# Altium schematic sheet DB_Power-X03.SchDoc: DB POWER (part 2 of 3)
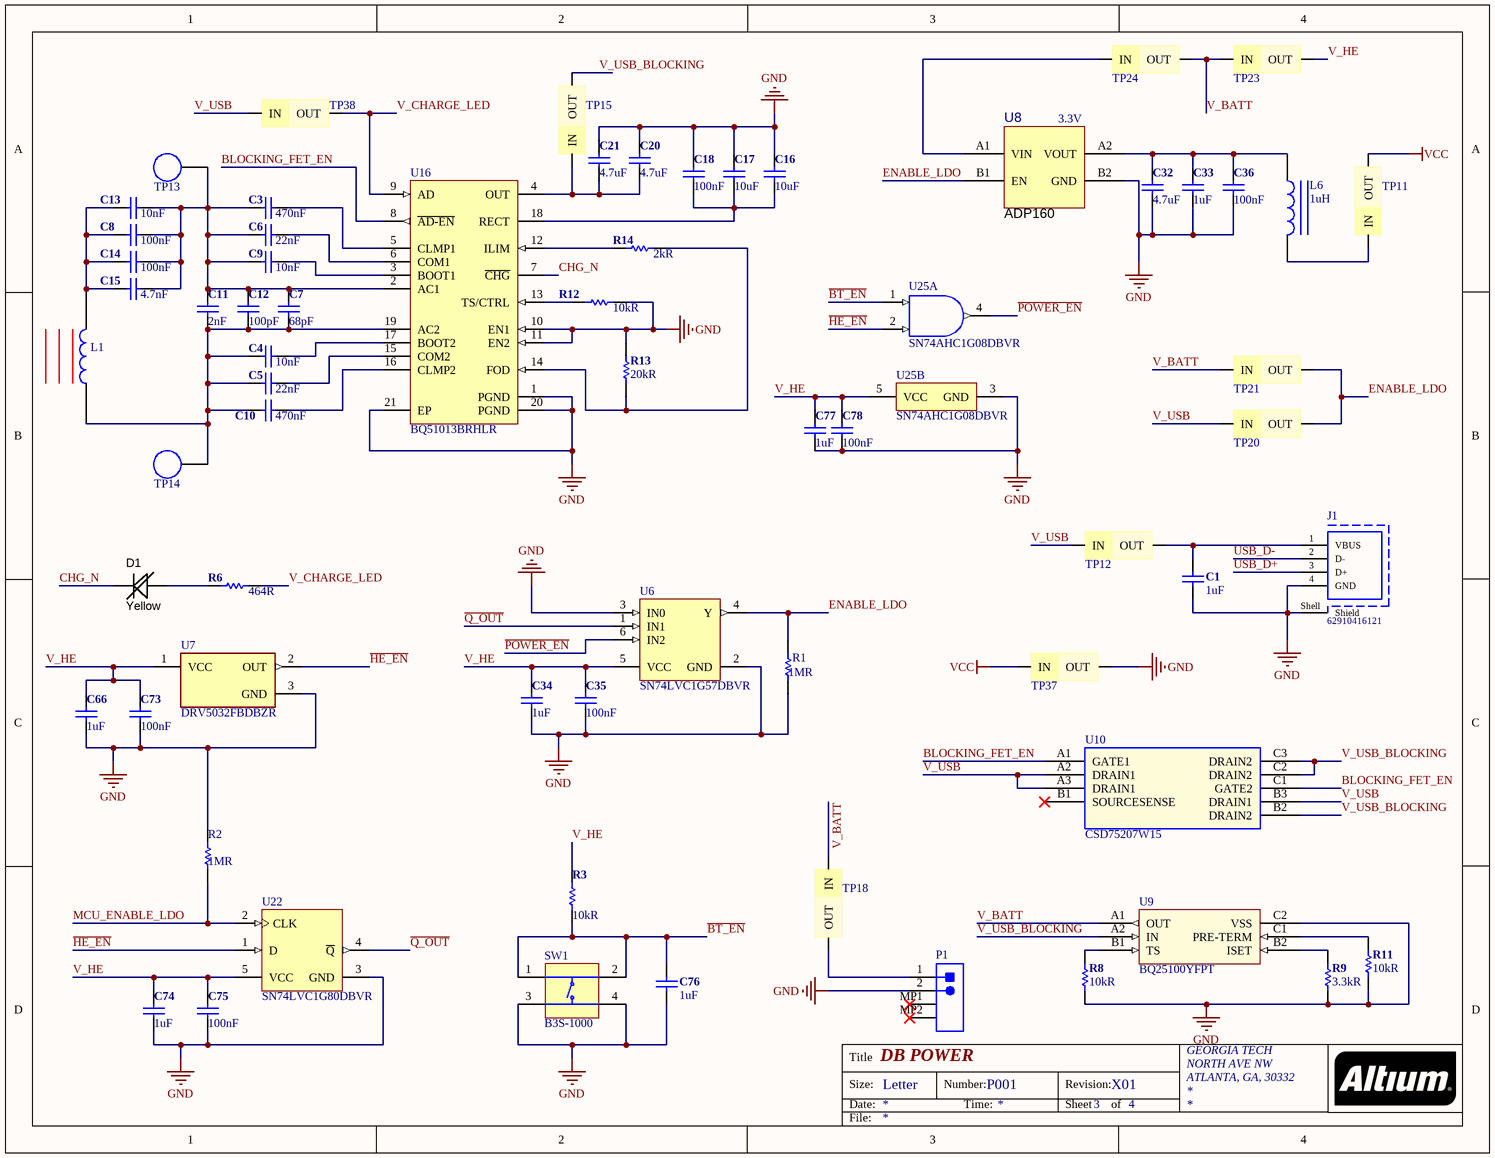
[diagram p1: DB_Power-X03.SchDoc]
## Library data of the parts
C1 C33 C34 C66 C74 C76 C77 = C-0402(1005): Ceramic Capacitor, Multilayer, Ceramic, 6.3V, 20% +Tol, 20% -Tol, X5R, 15% TC, 1uF, Surface Mount, 0402; Manufacturer: Yageo; Manufacturer Part Number: CC0402MRX5R5BB105; Dissipation Factor: 10%; ComponentLink1URL: https://datasheet.ciiva.com/169/product-169683.pdf; ComponentLink1Description: https://datasheet.ciiva.com/169/product-169683.pdf; Supplier 1: Digi-Key; Supplier Part Number 1: 311-1441-1-ND; RoHS: Yes; Category: Ceramic Capacitors; Stock 1: 16697; Pricing 1: 1=0.13000, 10=0.08900, 100=0.04200, 500=0.02946, 1000=0.02439, 2500=0.02270, 5000=0.02076 (USD); Mount: Surface Mount; Case/Package: 0402; Number of Pins: 2; Case Code (Imperial): 0402; Case Code (Metric): 1005; Min Operating Temperature: -55°C; Max Operating Temperature: 85°C; Capacitance: 1uF; Tolerance: 20%; Voltage Rating: 6.3V; Voltage Rating (DC): 6.3V; Packaging: Tape and Reel; Package Quantity: 1; Dielectric: X5R; Termination: SMD/SMT; Composition: Ceramic; Length: 1mm; Height: 0.5mm; Width: 0.5mm; Thickness: 0.022inch; Depth: 0.5mm; Lead Free: Lead Free; Halogen Free: Halogen Free; ComponentLink2URL: https://datasheet.ciiva.com:443/pdfs/VipMasterIC/IC/YAGO/YAGO-S-A0006851646/YAGO-S-A0006851646-1.pdf?src-supplier=IHS+Markit; ComponentLink2Description: https://datasheet.ciiva.com:443/pdfs/VipMasterIC/IC/YAGO/YAGO-S-A0006851646/YAGO-S-A0006851646-1.pdf?src-supplier=IHS+Markit; ComponentLink3URL: https://datasheet.ciiva.com/176/mlccorderingcode-176806.pdf?src-supplier=Digi-Key; ComponentLink3Description: https://datasheet.ciiva.com/176/mlccorderingcode-176806.pdf?src-supplier=Digi-Key; ComponentLink4URL: https://datasheet.ciiva.com/176/mlccorderingcode-176807.pdf?src-supplier=Digi-Key; ComponentLink4Description: https://datasheet.ciiva.com/176/mlccorderingcode-176807.pdf?src-supplier=Digi-Key; ComponentLink5URL: https://datasheet.ciiva.com/176/mlccorderingcode-176808.pdf?src-supplier=Digi-Key; ComponentLink5Description: https://datasheet.ciiva.com/176/mlccorderingcode-176808.pdf?src-supplier=Digi-Key
C3 C10 = C-0402(1005): Ceramic Capacitor, Multilayer, Ceramic, 25V, 20% +Tol, 20% -Tol, X5R, 15% TC, 0.47uF, Surface Mount, 0402; Manufacturer: Murata; Manufacturer Part Number: GRT155R61E474ME01D; ComponentLink1URL: https://datasheet.ciiva.com/169/product-169683.pdf; ComponentLink1Description: https://datasheet.ciiva.com/169/product-169683.pdf; Supplier 1: Digi-Key; Supplier Part Number 1: 490-12270-1-ND; RoHS: Yes; Category: Ceramic Capacitors; Stock 1: 59550; Pricing 1: 1=0.12000, 10=0.08400, 100=0.03930, 500=0.02754, 1000=0.02280, 2500=0.02122, 5000=0.01941 (USD); Mount: Surface Mount; Case/Package: 0402; Case Code (Metric): 1005; Case Code (Imperial): 0402; Min Operating Temperature: -55°C; Max Operating Temperature: 85°C; Packaging: Tape and Reel; Capacitance: 470nF; Voltage Rating: 25V; Tolerance: 20%; Length: 0.039inch; Width: 0.02inch; Thickness: 0.022inch; Ratings: AEC-Q200; ComponentLink2URL: https://datasheet.ciiva.com:443/pdfs/VipMasterIC/IC/MURE/MURE-S-A0004410517/MURE-S-A0004410723-1.pdf?src-supplier=IHS+Markit; ComponentLink2Description: https://datasheet.ciiva.com:443/pdfs/VipMasterIC/IC/MURE/MURE-S-A0004410517/MURE-S-A0004410723-1.pdf?src-supplier=IHS+Markit; ComponentLink3URL: http://search.murata.co.jp/Ceramy/image/img/A01X/G101/ENG/GRT155R61E474ME01-01.pdf?src-supplier=Digi-Key; ComponentLink3Description: http://search.murata.co.jp/Ceramy/image/img/A01X/G101/ENG/GRT155R61E474ME01-01.pdf?src-supplier=Digi-Key
C4 C9 = C-0402(1005): Ceramic Capacitor, Multilayer, Ceramic, 25V, 5% +Tol, 5% -Tol, X7R, 15% TC, 0.01uF, Surface Mount, 0402; Manufacturer: KEMET; Manufacturer Part Number: C0402C103J3RACTU; Dissipation Factor: 3.5%; ComponentLink1URL: https://datasheet.ciiva.com/169/product-169683.pdf; ComponentLink1Description: https://datasheet.ciiva.com/169/product-169683.pdf; Supplier 1: Digi-Key; Supplier Part Number 1: 399-1279-1-ND; RoHS: Yes; Category: Ceramic Capacitors; Stock 1: 2324889; Pricing 1: 1=0.10000, 10=0.05300, 100=0.02360, 500=0.01682, 1000=0.01322, 2500=0.01202, 5000=0.01106 (USD); Mount: Surface Mount,PCB; Case/Package: 0402; Number of Pins: 2; Dielectric Material: Ceramic; Case Code (Metric): 1005; Case Code (Imperial): 0402; Min Operating Temperature: -55°C; Max Operating Temperature: 125°C; Capacitance: 10nF; Packaging: Tape and Reel; Tolerance: 5%; Voltage Rating (DC): 25V; Termination: SMD/SMT; Package Quantity: 1; Voltage Rating: 25V; Dielectric: X7R; Voltage: 25V; Length: 1mm; Height: 0.5mm; Width: 0.02inch; Lead Pitch: 0.3mm; Thickness: 0.022inch; Depth: 0.5mm; Radiation Hardening: No; REACH SVHC: No SVHC; ComponentLink2URL: https://datasheet.ciiva.com:443/pdfs/VipMasterIC/IC/KEME/KEME-S-A0008991654/KEME-S-A0008991654-1.pdf?src-supplier=IHS+Markit; ComponentLink2Description: https://datasheet.ciiva.com:443/pdfs/VipMasterIC/IC/KEME/KEME-S-A0008991654/KEME-S-A0008991654-1.pdf?src-supplier=IHS+Markit; ComponentLink3URL: https://datasheet.ciiva.com/7747/1732724-7747610.pdf?src-supplier=Element14; ComponentLink3Description: https://datasheet.ciiva.com/7747/1732724-7747610.pdf?src-supplier=Element14; ComponentLink4URL: https://datasheet.ciiva.com/14603/70095383-14603973.pdf?src-supplier=Allied+Electronics; ComponentLink4Description: https://datasheet.ciiva.com/14603/70095383-14603973.pdf?src-supplier=Allied+Electronics; ComponentLink5URL: https://datasheet.ciiva.com/14607/70095383-14607438.pdf?src-supplier=Allied+Electronics; ComponentLink5Description: https://datasheet.ciiva.com/14607/70095383-14607438.pdf?src-supplier=Allied+Electronics
C5 C6 = C-0402(1005): Ceramic Capacitor, Multilayer, Ceramic, 25V, 10% +Tol, 10% -Tol, X7R, 15% TC, 0.022uF, Surface Mount, 0402; Manufacturer: Murata; Manufacturer Part Number: GRM155R71E223KA61D; ComponentLink1URL: https://datasheet.ciiva.com/169/product-169683.pdf; ComponentLink1Description: https://datasheet.ciiva.com/169/product-169683.pdf; Supplier 1: Digi-Key; Supplier Part Number 1: 490-3252-1-ND; RoHS: Yes; Category: Ceramic Capacitors; Stock 1: 465669; Pricing 1: 1=0.10000, 10=0.05800, 100=0.02600, 500=0.01860, 1000=0.01461, 2500=0.01328, 5000=0.01222 (USD); Mount: Surface Mount; Case/Package: 0402; Case Code (Metric): 1005; Case Code (Imperial): 0402; Min Operating Temperature: -55°C; Max Operating Temperature: 125°C; Capacitance: 22nF; Tolerance: 10%; Packaging: Tape and Reel; Package Quantity: 1; Voltage Rating: 25V; Dielectric: X7R; Termination: SMD/SMT; Voltage: 25V; Voltage Rating (DC): 25V; Length: 1mm; Height: 0.5mm; Width: 0.02inch; Thickness: 0.022inch; Depth: 0.5mm; Radiation Hardening: No; REACH SVHC: No SVHC; Lead Free: Lead Free; ComponentLink2URL: https://datasheet.ciiva.com:443/pdfs/VipMasterIC/IC/MURE/MURE-S-A0004362469/MURE-S-A0004364485-1.pdf?src-supplier=IHS+Markit; ComponentLink2Description: https://datasheet.ciiva.com:443/pdfs/VipMasterIC/IC/MURE/MURE-S-A0004362469/MURE-S-A0004364485-1.pdf?src-supplier=IHS+Markit; ComponentLink3URL: https://datasheet.ciiva.com/131/product-131108.pdf?src-supplier=Digi-Key; ComponentLink3Description: https://datasheet.ciiva.com/131/product-131108.pdf?src-supplier=Digi-Key; ComponentLink4URL: https://datasheet.ciiva.com/131/grm155r71e223ka61-01-131110.pdf?src-supplier=Digi-Key; ComponentLink4Description: https://datasheet.ciiva.com/131/grm155r71e223ka61-01-131110.pdf?src-supplier=Digi-Key; ComponentLink5URL: https://datasheet.ciiva.com/18184/getdatasheetpartid-178879-18184701.pdf?src-supplier=Verical; ComponentLink5Description: https://datasheet.ciiva.com/18184/getdatasheetpartid-178879-18184701.pdf?src-supplier=Verical; ComponentLink6URL: https://datasheet.ciiva.com/14103/grmseries-highdielectrictype-eng-14103752.pdf?src-supplier=Distrelec; ComponentLink6Description: https://datasheet.ciiva.com/14103/grmseries-highdielectrictype-eng-14103752.pdf?src-supplier=Distrelec; ComponentLink7URL: https://datasheet.ciiva.com/5414/product-5414091.pdf?src-supplier=Mouser; ComponentLink7Description: https://datasheet.ciiva.com/5414/product-5414091.pdf?src-supplier=Mouser; ComponentLink8URL: https://datasheet.ciiva.com/16396/product-16396813.pdf?src-supplier=Future+Electronics; ComponentLink8Description: https://datasheet.ciiva.com/16396/product-16396813.pdf?src-supplier=Future+Electronics; ComponentLink9URL: https://datasheet.ciiva.com/2989/product-2989390.pdf?src-supplier=Avnet; ComponentLink9Description: https://datasheet.ciiva.com/2989/product-2989390.pdf?src-supplier=Avnet
C7 = C-0402(1005): Ceramic Capacitor, Multilayer, Ceramic, 25V, 1% +Tol, 1% -Tol, C0G, 30ppm/Cel TC, 0.000068uF, Surface Mount, 0402; Manufacturer: KEMET; Manufacturer Part Number: CBR04C680F3GAC; ComponentLink1URL: https://datasheet.ciiva.com/169/product-169683.pdf; ComponentLink1Description: https://datasheet.ciiva.com/169/product-169683.pdf; Supplier 1: Digi-Key; Supplier Part Number 1: 399-11255-1-ND; RoHS: Yes; Category: Ceramic Capacitors; Stock 1: 36016; Pricing 1: 1=0.61000, 10=0.43000, 100=0.28320, 500=0.20974, 1000=0.17829, 2500=0.16780, 5000=0.15731 (USD); Mount: Surface Mount; Case/Package: 0402; Weight: 2.3E-05oz; Case Code (Metric): 1005; Case Code (Imperial): 0402; Min Operating Temperature: -55°C; Max Operating Temperature: 125°C; Package Quantity: 10000; Packaging: Tape and Reel; Capacitance: 68pF; Tolerance: 1%; Voltage Rating: 25V; Voltage Rating (DC): 25V; Dielectric: C0G; Termination: SMD/SMT; Length: 0.039inch; Height: 0.5mm; Width: 0.02inch; Thickness: 0.022inch; ComponentLink2URL: https://datasheet.ciiva.com:443/pdfs/VipMasterIC/IC/KEME/KEME-S-A0008534334/KEME-S-A0008534334-1.pdf?src-supplier=IHS+Markit; ComponentLink2Description: https://datasheet.ciiva.com:443/pdfs/VipMasterIC/IC/KEME/KEME-S-A0008534334/KEME-S-A0008534334-1.pdf?src-supplier=IHS+Markit; ComponentLink3URL: https://datasheet.ciiva.com/29542/docfinderpartnumber-cbr04c680f3gac-29542176.pdf?src-supplier=Digi-Key; ComponentLink3Description: https://datasheet.ciiva.com/29542/docfinderpartnumber-cbr04c680f3gac-29542176.pdf?src-supplier=Digi-Key; ComponentLink4URL: https://datasheet.ciiva.com/24220/kem-c1030-cbr-smd-346920-24220761.pdf?src-supplier=Mouser; ComponentLink4Description: https://datasheet.ciiva.com/24220/kem-c1030-cbr-smd-346920-24220761.pdf?src-supplier=Mouser; ComponentLink5URL: https://datasheet.ciiva.com/29542/kem-c1030-cbr-smd-29542174.pdf?src-supplier=Digi-Key; ComponentLink5Description: https://datasheet.ciiva.com/29542/kem-c1030-cbr-smd-29542174.pdf?src-supplier=Digi-Key; ComponentLink6URL: https://datasheet.ciiva.com/29542/kem-c1030-cbr-smd-29542175.pdf?src-supplier=Digi-Key; ComponentLink6Description: https://datasheet.ciiva.com/29542/kem-c1030-cbr-smd-29542175.pdf?src-supplier=Digi-Key
C8 C14 C35 C36 C73 C75 C78 = C-0402(1005): Ceramic Capacitor, Multilayer, Ceramic, 25V, 10% +Tol, 10% -Tol, X5R, 15% TC, 0.1uF, Surface Mount, 0402; Manufacturer: Taiyo Yuden; Manufacturer Part Number: TMK105BJ104KV-F; ComponentLink1URL: https://datasheet.ciiva.com/169/product-169683.pdf; ComponentLink1Description: https://datasheet.ciiva.com/169/product-169683.pdf; Supplier 1: Digi-Key; Supplier Part Number 1: 587-1456-1-ND; RoHS: Yes; Category: Ceramic Capacitors; Stock 1: 27456801; Pricing 1: 1=0.10000, 10=0.04600, 100=0.02050, 500=0.01464, 1000=0.01150, 2500=0.01045, 5000=0.00961 (USD); Mount: Surface Mount; Case/Package: 0402; Number of Pins: 2; Weight: 2.3E-05oz; Case Code (Imperial): 0402; Case Code (Metric): 1005; Min Operating Temperature: -55°C; Max Operating Temperature: 85°C; Capacitance: 100nF; Tolerance: 10%; Packaging: Tape and Reel; Dielectric: X5R; Voltage Rating (DC): 25V; Voltage Rating: 25V; Package Quantity: 1; Termination: SMD/SMT; Composition: Ceramic; Voltage: 25V; Length: 1mm; Height: 0.5mm; Width: 0.5mm; Depth: 0.5mm; Thickness: 0.022inch; REACH SVHC: No SVHC; Lead Free: Lead Free; Halogen Free: Halogen Free; ComponentLink2URL: https://datasheet.ciiva.com:443/pdfs/VipMasterIC/IC/TAIY/TAIY-S-A0009103435/TAIY-S-A0009103038-1.pdf?src-supplier=IHS+Markit; ComponentLink2Description: https://datasheet.ciiva.com:443/pdfs/VipMasterIC/IC/TAIY/TAIY-S-A0009103435/TAIY-S-A0009103038-1.pdf?src-supplier=IHS+Markit; ComponentLink3URL: https://datasheet.ciiva.com/30051/25tmk105bj104kv-f-30051094.pdf?src-supplier=Onlinecomponents.com; ComponentLink3Description: https://datasheet.ciiva.com/30051/25tmk105bj104kv-f-30051094.pdf?src-supplier=Onlinecomponents.com; ComponentLink4URL: https://datasheet.ciiva.com/15922/28tmk105bj104kv-f-15922315.pdf?src-supplier=Onlinecomponents.com; ComponentLink4Description: https://datasheet.ciiva.com/15922/28tmk105bj104kv-f-15922315.pdf?src-supplier=Onlinecomponents.com; ComponentLink5URL: https://datasheet.ciiva.com/131/tmk105bj104kv-f-ss-131420.pdf?src-supplier=Digi-Key; ComponentLink5Description: https://datasheet.ciiva.com/131/tmk105bj104kv-f-ss-131420.pdf?src-supplier=Digi-Key; ComponentLink6URL: https://datasheet.ciiva.com/22768/1693457-22768649.pdf?src-supplier=Farnell; ComponentLink6Description: https://datasheet.ciiva.com/22768/1693457-22768649.pdf?src-supplier=Farnell
C11 = C-0402(1005): Ceramic Capacitor, Multilayer, Ceramic, 25V, 5% +Tol, 5% -Tol, C0G, 30ppm/Cel TC, 0.002uF, Surface Mount, 0402; Manufacturer: KEMET; Manufacturer Part Number: C0402C202J3GACTU; ComponentLink1URL: https://datasheet.ciiva.com/169/product-169683.pdf; ComponentLink1Description: https://datasheet.ciiva.com/169/product-169683.pdf; Supplier 1: Digi-Key; Supplier Part Number 1: 399-9950-1-ND; RoHS: Yes; Category: Ceramic Capacitors; Stock 1: 112214; Pricing 1: 1=0.54000, 10=0.37900, 100=0.24970, 500=0.18496, 1000=0.15721, 2500=0.14796, 5000=0.13872 (USD); Mount: Surface Mount; Case/Package: 0402; Number of Pins: 2; Case Code (Metric): 1005; Case Code (Imperial): 0402; Dielectric Material: Ceramic; Min Operating Temperature: -55°C; Max Operating Temperature: 125°C; Capacitance: 2nF; Tolerance: 5%; Voltage Rating: 25V; Packaging: Cut Tape; Dielectric: C0G; Voltage Rating (DC): 25V; Package Quantity: 1; Length: 0.039inch; Lead Pitch: 0.3mm; Width: 0.02inch; Thickness: 0.022inch; Depth: 0.5mm; REACH SVHC: No SVHC; Lead Free: Lead Free; ComponentLink2URL: https://datasheet.ciiva.com:443/pdfs/VipMasterIC/IC/KEME/KEME-S-A0007617622/KEME-S-A0007609746-1.pdf?src-supplier=IHS+Markit; ComponentLink2Description: https://datasheet.ciiva.com:443/pdfs/VipMasterIC/IC/KEME/KEME-S-A0007617622/KEME-S-A0007609746-1.pdf?src-supplier=IHS+Markit; ComponentLink3URL: https://datasheet.ciiva.com/7747/1691965-7747484.pdf?src-supplier=Element14; ComponentLink3Description: https://datasheet.ciiva.com/7747/1691965-7747484.pdf?src-supplier=Element14; ComponentLink4URL: https://datasheet.ciiva.com/22693/1691965-22693900.pdf?src-supplier=Element14; ComponentLink4Description: https://datasheet.ciiva.com/22693/1691965-22693900.pdf?src-supplier=Element14
C12 = C-0402(1005): Ceramic Capacitor, Multilayer, Ceramic, 25V, 1% +Tol, 1% -Tol, C0G, -/+30ppm/Cel TC, 0.0001uF, 0402; Manufacturer: KEMET; Manufacturer Part Number: CBR04C101F3GAC; ComponentLink1URL: https://datasheet.ciiva.com/169/product-169683.pdf; ComponentLink1Description: https://datasheet.ciiva.com/169/product-169683.pdf; Supplier 1: Digi-Key; Supplier Part Number 1: 399-11246-1-ND; RoHS: Yes; Category: Ceramic Capacitors; Stock 1: 35333; Pricing 1: 1=0.57000, 10=0.40300, 100=0.26540, 500=0.19660, 1000=0.16710, 2500=0.15727, 5000=0.14744 (USD); Mount: Surface Mount; Case/Package: 0402; Weight: 2.3E-05oz; Case Code (Imperial): 0402; Case Code (Metric): 1005; Contact Plating: Tin,Matte; Min Operating Temperature: -55°C; Max Operating Temperature: 125°C; Capacitance: 100pF; Voltage Rating (DC): 25V; Tolerance: 1%; Packaging: Tape and Reel; Package Quantity: 10000; Voltage Rating: 25V; Dielectric: C0G; Termination: SMD/SMT; Length: 1mm; Height: 0.5mm; Width: 0.5mm; Thickness: 0.022inch; Lead Free: Lead Free; ComponentLink2URL: https://datasheet.ciiva.com:443/pdfs/VipMasterIC/IC/KEME/KEME-S-A0008534334/KEME-S-A0008534334-1.pdf?src-supplier=IHS+Markit; ComponentLink2Description: https://datasheet.ciiva.com:443/pdfs/VipMasterIC/IC/KEME/KEME-S-A0008534334/KEME-S-A0008534334-1.pdf?src-supplier=IHS+Markit; ComponentLink3URL: https://datasheet.ciiva.com/29541/docfinderpartnumber-cbr04c101f3gac-29541052.pdf?src-supplier=Digi-Key; ComponentLink3Description: https://datasheet.ciiva.com/29541/docfinderpartnumber-cbr04c101f3gac-29541052.pdf?src-supplier=Digi-Key; ComponentLink4URL: https://datasheet.ciiva.com/29541/kem-c1030-cbr-smd-29541054.pdf?src-supplier=Digi-Key; ComponentLink4Description: https://datasheet.ciiva.com/29541/kem-c1030-cbr-smd-29541054.pdf?src-supplier=Digi-Key; ComponentLink5URL: https://datasheet.ciiva.com/29541/kem-c1030-cbr-smd-29541053.pdf?src-supplier=Digi-Key; ComponentLink5Description: https://datasheet.ciiva.com/29541/kem-c1030-cbr-smd-29541053.pdf?src-supplier=Digi-Key
C13 = C-0402(1005): Ceramic Capacitor, Multilayer, Ceramic, 25V, 5% +Tol, 5% -Tol, X7R, 15% TC, 0.01uF, Surface Mount, 0402; Manufacturer: Yageo; Manufacturer Part Number: CC0402JRX7R8BB103; ComponentLink1URL: https://datasheet.ciiva.com/169/product-169683.pdf; ComponentLink1Description: https://datasheet.ciiva.com/169/product-169683.pdf; Supplier 1: Digi-Key; Supplier Part Number 1: 311-1677-1-ND; RoHS: Yes; Category: Ceramic Capacitors; Stock 1: 22771; Pricing 1: 1=0.10000, 10=0.04200, 100=0.01890, 500=0.01348, 1000=0.01059, 2500=0.00962, 5000=0.00886 (USD); Mount: Surface Mount; Case/Package: 0402; Weight: 2.3E-05oz; Case Code (Imperial): 0402; Case Code (Metric): 1005; Min Operating Temperature: -55°C; Max Operating Temperature: 125°C; Capacitance: 10nF; Tolerance: 5%; Dielectric: X7R; Packaging: Tape and Reel; Voltage Rating: 25V; Voltage Rating (DC): 25V; Termination: SMD/SMT; Composition: Ceramic; Length: 1mm; Height: 0.5mm; Width: 0.02inch; Thickness: 0.022inch; Depth: 0.5mm; Radiation Hardening: No; Lead Free: Lead Free; Halogen Free: Halogen Free; ComponentLink2URL: https://datasheet.ciiva.com:443/pdfs/VipMasterIC/IC/YAGO/YAGO-S-A0003557223/YAGO-S-A0003557223-1.pdf?src-supplier=IHS+Markit; ComponentLink2Description: https://datasheet.ciiva.com:443/pdfs/VipMasterIC/IC/YAGO/YAGO-S-A0003557223/YAGO-S-A0003557223-1.pdf?src-supplier=IHS+Markit; ComponentLink3URL: https://datasheet.ciiva.com/13208/upy-gphc-x7r-6-3v-to-50v-8-12304-13208812.pdf?src-supplier=Mouser; ComponentLink3Description: https://datasheet.ciiva.com/13208/upy-gphc-x7r-6-3v-to-50v-8-12304-13208812.pdf?src-supplier=Mouser; ComponentLink4URL: https://datasheet.ciiva.com/17434/upy-gphc-x7r-6-3v-to-50v-8-17434365.pdf?src-supplier=Avnet+Europe; ComponentLink4Description: https://datasheet.ciiva.com/17434/upy-gphc-x7r-6-3v-to-50v-8-17434365.pdf?src-supplier=Avnet+Europe
C15 = C-0402(1005): Ceramic Capacitor, Multilayer, Ceramic, 25V, 5% +Tol, 5% -Tol, X7R, 15% TC, 0.0047uF, Surface Mount, 0402; Manufacturer: Yageo; Manufacturer Part Number: CC0402JRX7R8BB472; ComponentLink1URL: https://datasheet.ciiva.com/169/product-169683.pdf; ComponentLink1Description: https://datasheet.ciiva.com/169/product-169683.pdf; Supplier 1: Digi-Key; Supplier Part Number 1: 311-3761-1-ND; RoHS: Yes; Category: Ceramic Capacitors; Stock 1: 13197; Pricing 1: 1=0.10000, 10=0.03800, 100=0.01710, 500=0.01224, 1000=0.00962, 2500=0.00874, 5000=0.00805 (USD); Mount: Surface Mount; Case/Package: 0402; Case Code (Imperial): 0402; Case Code (Metric): 1005; Min Operating Temperature: -55°C; Max Operating Temperature: 125°C; Voltage Rating (DC): 25V; Tolerance: 5%; Packaging: Tape and Reel; Capacitance: 4.7nF; Package Quantity: 10000; Voltage Rating: 25V; Termination: SMD/SMT; Dielectric: X7R; Length: 0.039inch; Width: 0.02inch; Thickness: 0.022inch; Depth: 0.5mm; Lead Free: Lead Free; Halogen Free: Halogen Free; ComponentLink2URL: https://datasheet.ciiva.com:443/pdfs/VipMasterIC/IC/YAGO/YAGO-S-A0003557223/YAGO-S-A0003557223-1.pdf?src-supplier=IHS+Markit; ComponentLink2Description: https://datasheet.ciiva.com:443/pdfs/VipMasterIC/IC/YAGO/YAGO-S-A0003557223/YAGO-S-A0003557223-1.pdf?src-supplier=IHS+Markit; ComponentLink3URL: https://datasheet.ciiva.com/5427/upy-gphc-x7r-6-3v-to-50v-8-12304-5427753.pdf?src-supplier=Mouser; ComponentLink3Description: https://datasheet.ciiva.com/5427/upy-gphc-x7r-6-3v-to-50v-8-12304-5427753.pdf?src-supplier=Mouser
C16 C17 = C-0603(1608): Ceramic Capacitor, Multilayer, Ceramic, 25V, 20% +Tol, 20% -Tol, X5R, 15% TC, 10uF, Surface Mount, 0603; Manufacturer: Murata; Manufacturer Part Number: GRM188R61E106MA73J; ComponentLink1URL: https://datasheet.ciiva.com/169/product-169683.pdf; ComponentLink1Description: https://datasheet.ciiva.com/169/product-169683.pdf; Supplier 1: Digi-Key; Supplier Part Number 1: 490-12737-1-ND; RoHS: Yes; Category: Ceramic Capacitors; Stock 1: 57394; Pricing 1: 1=0.46000, 10=0.32200, 100=0.19320, 500=0.14488, 1000=0.12235, 2500=0.11591, 5000=0.10947 (USD); Mount: Surface Mount; Case/Package: 0603; Weight: 0.000222oz; Case Code (Imperial): 0603; Case Code (Metric): 1608; Min Operating Temperature: -55°C; Max Operating Temperature: 85°C; Tolerance: 20%; Packaging: Tape and Reel; Capacitance: 10uF; Voltage Rating: 25V; Dielectric: X5R; Termination: SMD/SMT; Composition: Ceramic; Voltage Rating (DC): 25V; Package Quantity: 10000; Length: 0.063inch; Height: 0.8mm; Width: 0.031inch; Thickness: 0.039inch; ComponentLink2URL: https://datasheet.ciiva.com:443/pdfs/VipMasterIC/IC/MURE/MURE-S-A0004349797/MURE-S-A0004352800-1.pdf?src-supplier=IHS+Markit; ComponentLink2Description: https://datasheet.ciiva.com:443/pdfs/VipMasterIC/IC/MURE/MURE-S-A0004349797/MURE-S-A0004352800-1.pdf?src-supplier=IHS+Markit; ComponentLink3URL: http://www.mouser.com/ds/2/281/GRM188R61E106MA73-01-1064626.pdf?src-supplier=Mouser; ComponentLink3Description: http://www.mouser.com/ds/2/281/GRM188R61E106MA73-01-1064626.pdf?src-supplier=Mouser; ComponentLink4URL: https://search.murata.co.jp/Ceramy/image/img/A01X/G101/ENG/GRM188R61E106MA73-01.pdf?src-supplier=Digi-Key; ComponentLink4Description: https://search.murata.co.jp/Ceramy/image/img/A01X/G101/ENG/GRM188R61E106MA73-01.pdf?src-supplier=Digi-Key
C18 = C-0603(1608): Ceramic Capacitor, Multilayer, Ceramic, 25V, 80% +Tol, 20% -Tol, Y5V, -82/+22% TC, 0.1uF, Surface Mount, 0402; Manufacturer: Yageo; Manufacturer Part Number: CC0402ZRY5V8BB104; Dissipation Factor: 12.5%; Insulation Resistance: 10GR; ComponentLink1URL: https://datasheet.ciiva.com/169/product-169683.pdf; ComponentLink1Description: https://datasheet.ciiva.com/169/product-169683.pdf; Supplier 1: Digi-Key; Supplier Part Number 1: 311-1375-1-ND; RoHS: Yes; Category: Ceramic Capacitors; Stock 1: 3200380; Pricing 1: 1=0.10000, 10=0.03200, 100=0.01440, 500=0.01028, 1000=0.00808, 2500=0.00734, 5000=0.00676 (USD); Mount: Surface Mount; Case/Package: 0402; Number of Pins: 2; Weight: 2.3E-05oz; Case Code (Metric): 1005; Case Code (Imperial): 0402; Min Operating Temperature: -30°C; Max Operating Temperature: 85°C; Packaging: Tape and Reel; Capacitance: 100nF; Tolerance: 80%; Voltage Rating: 25V; Voltage Rating (DC): 25V; Package Quantity: 1; Dielectric: Y5V; Termination: SMD/SMT; Composition: Ceramic; Length: 1mm; Height: 0.5mm; Width: 0.02inch; Thickness: 0.022inch; Depth: 0.5mm; Radiation Hardening: No; REACH SVHC: Unknown; Lead Free: Lead Free; Halogen Free: Halogen Free; ComponentLink2URL: https://datasheet.ciiva.com:443/pdfs/VipMasterIC/IC/YAGO/YAGO-S-A0004841839/YAGO-S-A0004841839-1.pdf?src-supplier=IHS+Markit; ComponentLink2Description: https://datasheet.ciiva.com:443/pdfs/VipMasterIC/IC/YAGO/YAGO-S-A0004841839/YAGO-S-A0004841839-1.pdf?src-supplier=IHS+Markit; ComponentLink3URL: https://datasheet.ciiva.com/144/mlccorderingcode-144022.pdf?src-supplier=Digi-Key; ComponentLink3Description: https://datasheet.ciiva.com/144/mlccorderingcode-144022.pdf?src-supplier=Digi-Key; ComponentLink4URL: https://datasheet.ciiva.com/144/mlccorderingcode-144023.pdf?src-supplier=Digi-Key; ComponentLink4Description: https://datasheet.ciiva.com/144/mlccorderingcode-144023.pdf?src-supplier=Digi-Key; ComponentLink5URL: https://datasheet.ciiva.com/144/mlccorderingcode-144024.pdf?src-supplier=Digi-Key; ComponentLink5Description: https://datasheet.ciiva.com/144/mlccorderingcode-144024.pdf?src-supplier=Digi-Key; ComponentLink6URL: https://datasheet.ciiva.com/7978/1132289-7978124.pdf?src-supplier=Element14; ComponentLink6Description: https://datasheet.ciiva.com/7978/1132289-7978124.pdf?src-supplier=Element14; ComponentLink7URL: https://datasheet.ciiva.com/11586/upy-gphc-y5v-6-3v-to-50v-5-11586526.pdf?src-supplier=Avnet; ComponentLink7Description: https://datasheet.ciiva.com/11586/upy-gphc-y5v-6-3v-to-50v-5-11586526.pdf?src-supplier=Avnet; ComponentLink8URL: https://datasheet.ciiva.com/17437/upy-gphc-y5v-6-3v-to-50v-5-17437230.pdf?src-supplier=Avnet+Europe; ComponentLink8Description: https://datasheet.ciiva.com/17437/upy-gphc-y5v-6-3v-to-50v-5-17437230.pdf?src-supplier=Avnet+Europe
C20 C21 C32 = C-0402(1005): 0402 10 V 4.7 uF ±20% Tolerance X5R Multilayer Ceramic Chip Capacitor; Manufacturer: Murata; Manufacturer Part Number: GRM155R61A475MEAAD; Voltage Rating: 10V; ComponentLink1URL: https://datasheet.ciiva.com/169/product-169683.pdf; ComponentLink1Description: https://datasheet.ciiva.com/169/product-169683.pdf; Supplier 1: Digi-Key; Supplier Part Number 1: 490-14306-1-ND; Category: Ceramic Capacitors; Stock 1: 420733; Pricing 1: 1=0.25000, 10=0.16900, 100=0.08560, 500=0.05854, 1000=0.05179, 2500=0.04954, 5000=0.04503 (USD); Mount: Surface Mount; Case/Package: 0402; Case Code (Imperial): 0402; Case Code (Metric): 1005; Min Operating Temperature: -55°C; Max Operating Temperature: 85°C; Packaging: Tape and Reel; Capacitance: 4.7uF; Tolerance: 20%; ComponentLink2URL: https://psearch.en.murata.com:443/capacitor/product/GRM155R61A475MEAA%23.pdf?src-supplier=IHS+Markit; ComponentLink2Description: https://psearch.en.murata.com:443/capacitor/product/GRM155R61A475MEAA%23.pdf?src-supplier=IHS+Markit; ComponentLink3URL: http://www.farnell.com/datasheets/2189109.pdf?src-supplier=Farnell; ComponentLink3Description: http://www.farnell.com/datasheets/2189109.pdf?src-supplier=Farnell; ComponentLink4URL: https://search.murata.co.jp/Ceramy/image/img/A01X/G101/ENG/GRM155R61A475MEAA-01.pdf?src-supplier=Digi-Key; ComponentLink4Description: https://search.murata.co.jp/Ceramy/image/img/A01X/G101/ENG/GRM155R61A475MEAA-01.pdf?src-supplier=Digi-Key; ComponentLink5URL: http://www.farnell.com/datasheets/2189109.pdf?src-supplier=Element14; ComponentLink5Description: http://www.farnell.com/datasheets/2189109.pdf?src-supplier=Element14; ComponentLink6URL: http://www.farnell.com/datasheets/2189109.pdf?src-supplier=Newark; ComponentLink6Description: http://www.farnell.com/datasheets/2189109.pdf?src-supplier=Newark; ComponentLink7URL: http://datasheet.octopart.com/GRM155R61A475MEAAD-Murata-datasheet-138740730.pdf?src-supplier=Ciiva+Crawler; ComponentLink7Description: http://datasheet.octopart.com/GRM155R61A475MEAAD-Murata-datasheet-138740730.pdf?src-supplier=Ciiva+Crawler; ComponentLink8URL: http://datasheet.octopart.com/GRM155R61A475MEAAD-Murata-datasheet-140690084.pdf?src-supplier=Ciiva+Crawler; ComponentLink8Description: http://datasheet.octopart.com/GRM155R61A475MEAAD-Murata-datasheet-140690084.pdf?src-supplier=Ciiva+Crawler; ComponentLink9URL: http://datasheet.octopart.com/GRM155R61A475MEAAD-Murata-datasheet-68589269.pdf?src-supplier=Newark; ComponentLink9Description: http://datasheet.octopart.com/GRM155R61A475MEAAD-Murata-datasheet-68589269.pdf?src-supplier=Newark; ComponentLink10URL: http://datasheet.octopart.com/GRM155R61A475MEAAD-Murata-datasheet-8819587.pdf; ComponentLink10Description: http://datasheet.octopart.com/GRM155R61A475MEAAD-Murata-datasheet-8819587.pdf; ComponentLink11URL: http://datasheet.octopart.com/GRM155R61A475MEAAD-Murata-datasheet-10025737.pdf; ComponentLink11Description: http://datasheet.octopart.com/GRM155R61A475MEAAD-Murata-datasheet-10025737.pdf; ComponentLink12URL: http://datasheet.octopart.com/GRM155R61A475MEAAD-Murata-datasheet-11978611.pdf; ComponentLink12Description: http://datasheet.octopart.com/GRM155R61A475MEAAD-Murata-datasheet-11978611.pdf; ComponentLink13URL: http://datasheet.octopart.com/GRM155R61A475MEAAD-Murata-datasheet-12510076.pdf; ComponentLink13Description: http://datasheet.octopart.com/GRM155R61A475MEAAD-Murata-datasheet-12510076.pdf; ComponentLink14URL: http://datasheet.octopart.com/GRM155R61A475MEAAD-Murata-datasheet-12515295.pdf; ComponentLink14Description: http://datasheet.octopart.com/GRM155R61A475MEAAD-Murata-datasheet-12515295.pdf
D1 = LED_0402(1005): Single Color LED, Super Bright Yellow, Water Clear, 0.8mm; Manufacturer: Kingbright; Manufacturer Part Number: APHHS1005SYCK; Test Current: 20mA; Forward Voltage: 2V; Luminous Intensity: 150mcd; Viewing Angle: 120°; Number of LEDs: 1; Dominant Wavelength: 590nm; Lens Style: Clear,Flat; Supplier 1: Digi-Key; Supplier Part Number 1: 754-1105-1-ND; RoHS: Yes; Category: LEDs; Stock 1: 1790; Pricing 1: 1=0.44000, 10=0.31200, 100=0.18200, 500=0.12480, 1000=0.10400 (USD); Mount: Surface Mount; Case/Package: 0402; Number of Pins: 2; Color: Yellow; Case Code (Imperial): 0402; Case Code (Metric): 1005; Lens Color: Clear; Min Operating Temperature: -40°C; Max Operating Temperature: 85°C; Illumination Color: Yellow; Forward Current: 20mA; Packaging: Tape and Reel; Package Quantity: 2000; Length: 1mm; Height: 0.6mm; Width: 0.5mm; Lead Free: Lead Free; ComponentLink1URL: https://datasheet.ciiva.com:443/pdfs/VipMasterIC/IC/KBEC/KBEC-S-A0008947180/KBEC-S-A0008958019-1.pdf?src-supplier=IHS+Markit; ComponentLink1Description: https://datasheet.ciiva.com:443/pdfs/VipMasterIC/IC/KBEC/KBEC-S-A0008947180/KBEC-S-A0008958019-1.pdf?src-supplier=IHS+Markit; ComponentLink2URL: https://datasheet.ciiva.com/4688/aphhs1005syck-76875-4688936.pdf?src-supplier=Mouser; ComponentLink2Description: https://datasheet.ciiva.com/4688/aphhs1005syck-76875-4688936.pdf?src-supplier=Mouser; ComponentLink3URL: https://datasheet.ciiva.com/2114/aphhs1005syck-2114041.pdf?src-supplier=Digi-Key; ComponentLink3Description: https://datasheet.ciiva.com/2114/aphhs1005syck-2114041.pdf?src-supplier=Digi-Key; ComponentLink4URL: https://datasheet.ciiva.com/14603/70062834-14603866.pdf?src-supplier=Allied+Electronics; ComponentLink4Description: https://datasheet.ciiva.com/14603/70062834-14603866.pdf?src-supplier=Allied+Electronics; ComponentLink5URL: https://datasheet.ciiva.com/2114/aphhs1005syck-2114043.pdf?src-supplier=Digi-Key; ComponentLink5Description: https://datasheet.ciiva.com/2114/aphhs1005syck-2114043.pdf?src-supplier=Digi-Key; ComponentLink6URL: https://datasheet.ciiva.com/16412/aphhs1005syck-16412188.pdf?src-supplier=Future+Electronics; ComponentLink6Description: https://datasheet.ciiva.com/16412/aphhs1005syck-16412188.pdf?src-supplier=Future+Electronics
J1 = CMP-1502-03244-1: USB 2.0 Type B Receptacle WR-COM, Horizontal, SMT, with Pads and Pegs; Manufacturer: Wurth Electronics; Number of Contacts: 4; USB Standard: USB 2.0; Number of Ports: 1; Current Rating: 1.5A; Mating Cycles: 1500; Shielding: Shielded; Supplier 1: Digi-Key; Supplier Part Number 1: 732-3152-1-ND; Manufacturer Part Number: 62910416121; RoHS: Yes; Category: Connectors; Stock 1: 80; Pricing 1: 1=3.83000, 10=3.76300, 50=3.49400, 100=3.22600 (USD); Mount: Surface Mount; Contact Plating: Gold; Contact Material: Copper Alloy; Insulation Color: Black; Min Operating Temperature: -40°C; Max Operating Temperature: 105°C; Package Quantity: 150; Packaging: Tape and Reel; Gender: Receptacle; Connector Type: USB; Termination: Solder; Orientation: Right Angle; Features: Shielded; Length: 16mm; REACH SVHC: Unknown; Lead Free: Lead Free; Flammability Rating: UL94 V-0; ComponentLink1URL: https://datasheet.ciiva.com:443/pdfs/VipMasterIC/IC/MIDC/MIDC-S-A0004022663/MIDC-S-A0003061583-1.pdf?src-supplier=IHS+Markit; ComponentLink1Description: https://datasheet.ciiva.com:443/pdfs/VipMasterIC/IC/MIDC/MIDC-S-A0004022663/MIDC-S-A0003061583-1.pdf?src-supplier=IHS+Markit; ComponentLink2URL: https://datasheet.ciiva.com/851/62910416121-851244.pdf?src-supplier=Digi-Key; ComponentLink2Description: https://datasheet.ciiva.com/851/62910416121-851244.pdf?src-supplier=Digi-Key; ComponentLink3URL: https://datasheet.ciiva.com/851/62910416121-851245.pdf?src-supplier=Digi-Key; ComponentLink3Description: https://datasheet.ciiva.com/851/62910416121-851245.pdf?src-supplier=Digi-Key; ComponentLink4URL: https://datasheet.ciiva.com/851/62910416121-851246.pdf?src-supplier=Digi-Key; ComponentLink4Description: https://datasheet.ciiva.com/851/62910416121-851246.pdf?src-supplier=Digi-Key
L1 = WIRELESS_CHARGING_COIL: General Purpose Inductor, 11.8uH, 10%, 1 Element; Manufacturer: Wurth Electronics; Current Rating: 700mA; Saturation Current: 1.5A; DC Resistance (DCR): 750mR; Self Resonant Frequency: 22MHz; Supplier 1: Digi-Key; Supplier Part Number 1: 732-9675-ND; Manufacturer Part Number: 760308101219; RoHS: Yes; Stock 1: 168; Pricing 1: 1=7.43000, 10=7.04000, 32=6.49000, 64=5.94000, 128=5.17000 (USD); Min Operating Temperature: -20°C; Max Operating Temperature: 105°C; Logic Function: Receiver; Inductance: 11.8uH; Tolerance: 10%; Inductance Tolerance: 10%; Height: 0.02inch; REACH SVHC: Unknown; ComponentLink1URL: https://datasheet.ciiva.com:443/pdfs/VipMasterIC/IC/MIDC/MIDC-S-A0003386501/MIDC-S-A0003386501-1.pdf?src-supplier=IHS+Markit; ComponentLink1Description: https://datasheet.ciiva.com:443/pdfs/VipMasterIC/IC/MIDC/MIDC-S-A0003386501/MIDC-S-A0003386501-1.pdf?src-supplier=IHS+Markit; ComponentLink2URL: http://www.farnell.com/datasheets/2039993.pdf?src-supplier=Farnell; ComponentLink2Description: http://www.farnell.com/datasheets/2039993.pdf?src-supplier=Farnell; ComponentLink3URL: http://www.farnell.com/datasheets/2039993.pdf?src-supplier=Element14; ComponentLink3Description: http://www.farnell.com/datasheets/2039993.pdf?src-supplier=Element14
L6 = Inductor Iron: General Purpose Inductor, 1uH, 20%, 1 Element, Ferrite-Core, SMD, 0402; Manufacturer: TDK; Manufacturer Part Number: MLZ1005M1R0WT000; Current Rating: 450mA; Saturation Current: 100mA; Shielding: Shielded; DC Resistance (DCR): 455mR; Self Resonant Frequency: 170MHz; Test Frequency: 2MHz; Supplier 1: Digi-Key; Supplier Part Number 1: 445-6379-1-ND; RoHS: Yes; Category: Fixed Inductors; Pricing 1: 1=0.29000, 10=0.25800, 100=0.17710, 500=0.15134, 1000=0.11592, 2500=0.10948 (USD); Mount: Surface Mount; Case/Package: 0402; Core Material: Ferrite; Case Code (Imperial): 0402; Case Code (Metric): 1005; Min Operating Temperature: -55°C; Max Operating Temperature: 125°C; Package Quantity: 10000; Packaging: Tape and Reel; Tolerance: 20%; Inductance: 1uH; Length: 0.039inch; Width: 0.02inch; Height - Seated (Max): 0.022inch; ComponentLink1URL: https://datasheet.ciiva.com:443/pdfs/VipMasterIC/IC/TDKC/TDKC-S-A0006811779/TDKC-S-A0006811779-1.pdf?src-supplier=IHS+Markit; ComponentLink1Description: https://datasheet.ciiva.com:443/pdfs/VipMasterIC/IC/TDKC/TDKC-S-A0006811779/TDKC-S-A0006811779-1.pdf?src-supplier=IHS+Markit; ComponentLink2URL: https://datasheet.ciiva.com/29699/inductor-commercial-decoupling-mlz-en-29699052.pdf?src-supplier=Digi-Key; ComponentLink2Description: https://datasheet.ciiva.com/29699/inductor-commercial-decoupling-mlz-en-29699052.pdf?src-supplier=Digi-Key; ComponentLink3URL: https://datasheet.ciiva.com/29699/inductor-commercial-decoupling-mlz-en-29699053.pdf?src-supplier=Digi-Key; ComponentLink3Description: https://datasheet.ciiva.com/29699/inductor-commercial-decoupling-mlz-en-29699053.pdf?src-supplier=Digi-Key
P1 = CMP-2000-05163-1: Male Header, Pitch 2 mm, 1 x 2 Position, Height 6.6 mm, RoHS, Tape and Reel; Manufacturer: JST; Current Rating: 2A; Contact Resistance: 20mR; Number of Positions: 2; Insulation Resistance: 1GR; Working Voltage: 100V; Connector Type: Header,Male Pin; Pitch: 2mm; Supplier 1: Digi-Key; Supplier Part Number 1: 455-1734-1-ND; Manufacturer Part Number: B2B-PH-SM4-TB(LF)(SN); RoHS: Yes; Category: Connectors; Stock 1: 32200; Pricing 1: 1=0.55000, 10=0.52000, 100=0.39870, 500=0.34668 (USD); Mount: Surface Mount; Contact Material: Copper Alloy,Tin,Bronze,Brass; Contact Plating: Tin,Copper; Color: Natural,White; Housing Color: Beige; Housing Material: Polyamide; Contact Shape: Square; Insulation Material: Nylon; Insulation Color: Natural; Min Operating Temperature: -25°C; Max Operating Temperature: 85°C; Number of Rows: 1; Packaging: Tape and Reel; Termination: Solder; Fastening Type: Detent; Number of Contacts: 2; Orientation: Straight; Gender: Male; Max Current Rating: 2A; Max Voltage Rating (AC): 100V; Number of Poles: 2; Voltage Rating (AC): 100V; Voltage Rating: 100V; Length: 7.95mm; Height: 9.4mm; Width: 5.5mm; Depth: 5mm; Lead Pitch: 2mm; Contact Mating Length: 0.13inch; REACH SVHC: No SVHC; Lead Free: Lead Free; Flammability Rating: UL94 V-0; ComponentLink1URL: https://datasheet.ciiva.com/11748/0900766b80ddea81-11748001.pdf?src-supplier=RSComponents; ComponentLink1Description: https://datasheet.ciiva.com/11748/0900766b80ddea81-11748001.pdf?src-supplier=RSComponents; ComponentLink2URL: https://datasheet.ciiva.com/16216/b2b-ph-sm4-tblfsn-16216102.pdf?src-supplier=Future+Electronics; ComponentLink2Description: https://datasheet.ciiva.com/16216/b2b-ph-sm4-tblfsn-16216102.pdf?src-supplier=Future+Electronics; ComponentLink3URL: https://datasheet.ciiva.com/8052/80567-8052023.pdf?src-supplier=Element14; ComponentLink3Description: https://datasheet.ciiva.com/8052/80567-8052023.pdf?src-supplier=Element14; ComponentLink4URL: https://datasheet.ciiva.com/712/eph-712504.pdf?src-supplier=Digi-Key; ComponentLink4Description: https://datasheet.ciiva.com/712/eph-712504.pdf?src-supplier=Digi-Key; ComponentLink5URL: https://datasheet.ciiva.com/712/eph-712505.pdf?src-supplier=Digi-Key; ComponentLink5Description: https://datasheet.ciiva.com/712/eph-712505.pdf?src-supplier=Digi-Key; ComponentLink6URL: https://datasheet.ciiva.com/712/eph-712506.pdf?src-supplier=Digi-Key; ComponentLink6Description: https://datasheet.ciiva.com/712/eph-712506.pdf?src-supplier=Digi-Key
R1 R2 = CMP-2002-01800-1: 100 ohm resistor; Manufacturer: Yageo; Power Rating: 62.5mW; Tolerance: 1%; Voltage Rating: 50V; Temperature Coefficient: 100ppm/°C; Max Power Dissipation: 63mW; Supplier 1: Digi-Key; Supplier Part Number 1: YAG3450CT-ND; Manufacturer Part Number: AC0402FR-071ML; RoHS: Yes; Category: Chip SMD Resistors; Stock 1: 116965; Pricing 1: 1=0.10000, 10=0.02100, 100=0.00870, 1000=0.00390, 2500=0.00338, 5000=0.00279 (USD); Case/Package: 0402; Case Code (Imperial): 0402; Case Code (Metric): 1005; Min Operating Temperature: -55°C; Max Operating Temperature: 155°C; Packaging: Tape and Reel; Termination: SMD/SMT; Composition: Thick Film; Number of Terminations: 2; Military Standard: Not; Features: Moisture Resistant,Automotive AEC-Q200; Length: 1mm; Height: 0.015inch; Width: 0.5mm; Depth: 0.5mm; Lead Free: Lead Free; ComponentLink1URL: https://datasheet.ciiva.com:443/pdfs/VipMasterIC/IC/YAGO/YAGO-S-A0003597364/YAGO-S-A0003597364-1.pdf?src-supplier=IHS+Markit; ComponentLink1Description: https://datasheet.ciiva.com:443/pdfs/VipMasterIC/IC/YAGO/YAGO-S-A0003597364/YAGO-S-A0003597364-1.pdf?src-supplier=IHS+Markit; ComponentLink2URL: http://components.arrow.com/part/dataview/0323_03348700?src-supplier=Arrow+Europe; ComponentLink2Description: http://components.arrow.com/part/dataview/0323_03348700?src-supplier=Arrow+Europe; ComponentLink3URL: http://www.yageo.com/documents/recent/PYu-AC_51_RoHS_L_2_revised.pdf?src-supplier=Future+Electronics; ComponentLink3Description: http://www.yageo.com/documents/recent/PYu-AC_51_RoHS_L_2_revised.pdf?src-supplier=Future+Electronics; ComponentLink4URL: http://www.yageo.com/NewPortal/yageodocoutput?fileName=/pdf/R-Chip/PYu-AC_51_RoHS_L_6.pdf&src-supplier=Digi-Key; ComponentLink4Description: http://www.yageo.com/NewPortal/yageodocoutput?fileName=/pdf/R-Chip/PYu-AC_51_RoHS_L_6.pdf&src-supplier=Digi-Key; ComponentLink5URL: http://www.yageo.com/documents/recent/PYu-AC_51_RoHS_L_2.pdf?src-supplier=Mouser; ComponentLink5Description: http://www.yageo.com/documents/recent/PYu-AC_51_RoHS_L_2.pdf?src-supplier=Mouser
R3 R8 R11 R12 = R-0402(1005): Fixed Resistor, Metal Glaze/thick Film, 0.0625W, 10000ohm, 50V, 1% +/-Tol, 100ppm/Cel, Surface Mount, 0402; Manufacturer: Yageo; Manufacturer Part Number: AC0402FR-0710KL; Power Rating: 62.5mW; Temperature Coefficient: 100ppm/°C; Max Power Dissipation: 63mW; Supplier 1: Digi-Key; Supplier Part Number 1: YAG3436CT-ND; RoHS: Yes; Category: Chip SMD Resistors; Stock 1: 922338; Pricing 1: 1=0.10000, 10=0.02100, 100=0.00870, 1000=0.00390, 2500=0.00338, 5000=0.00279 (USD); Case/Package: 0402; Case Code (Imperial): 0402; Case Code (Metric): 1005; Min Operating Temperature: -55°C; Max Operating Temperature: 155°C; Resistance: 10kR; Tolerance: 1%; Voltage Rating: 50V; Packaging: Tape and Reel; Composition: Thick Film; Termination: SMD/SMT; Number of Terminations: 2; Military Standard: Not; Features: Moisture Resistant,Automotive AEC-Q200; Length: 0.039inch; Height: 0.015inch; Width: 0.02inch; Depth: 0.5mm; Lead Free: Lead Free; ComponentLink1URL: https://datasheet.ciiva.com:443/pdfs/VipMasterIC/IC/YAGO/YAGO-S-A0003597364/YAGO-S-A0003597364-1.pdf?src-supplier=IHS+Markit; ComponentLink1Description: https://datasheet.ciiva.com:443/pdfs/VipMasterIC/IC/YAGO/YAGO-S-A0003597364/YAGO-S-A0003597364-1.pdf?src-supplier=IHS+Markit; ComponentLink2URL: https://datasheet.ciiva.com/12656/pyu-ac-51-rohs-l-2-12656634.pdf?src-supplier=Mouser; ComponentLink2Description: https://datasheet.ciiva.com/12656/pyu-ac-51-rohs-l-2-12656634.pdf?src-supplier=Mouser
R6 = R-0402(1005): Fixed Resistor, Metal Glaze/thick Film, 0.0625W, 464ohm, 50V, 1% +/-Tol, 100ppm/Cel, Surface Mount, 0402; Manufacturer: Yageo; Manufacturer Part Number: RC0402FR-07464RL; Power Rating: 62.5mW; Max Power Dissipation: 63mW; Temperature Coefficient: 100ppm/°C; Supplier 1: Digi-Key; Supplier Part Number 1: 311-464LRCT-ND; RoHS: Yes; Category: Chip SMD Resistors; Stock 1: 10914; Pricing 1: 1=0.10000, 10=0.01600, 100=0.00640, 1000=0.00289, 2500=0.00251, 5000=0.00207 (USD); Case/Package: 0402; Weight: 2.3E-05oz; Case Code (Metric): 1005; Case Code (Imperial): 0402; Contact Plating: Tin,Matte; Min Operating Temperature: -55°C; Max Operating Temperature: 155°C; Resistance: 464R; Tolerance: 1%; Package Quantity: 1; Packaging: Tape and Reel; Voltage Rating: 50V; Composition: Thick Film; Number of Terminations: 2; Termination: SMD/SMT; Military Standard: Not; Voltage Rating (DC): 50V; Features: Moisture Resistant; Length: 1mm; Height: 0.016inch; Width: 0.02inch; Depth: 0.5mm; Lead Free: Lead Free; ComponentLink1URL: https://datasheet.ciiva.com:443/pdfs/VipMasterIC/IC/YAGO/YAGO-S-A0008145938/YAGO-S-A0008145938-1.pdf?src-supplier=IHS+Markit; ComponentLink1Description: https://datasheet.ciiva.com:443/pdfs/VipMasterIC/IC/YAGO/YAGO-S-A0008145938/YAGO-S-A0008145938-1.pdf?src-supplier=IHS+Markit; ComponentLink2URL: https://datasheet.ciiva.com/2519/pyu-r-int-thick-7-2519093.pdf?src-supplier=Digi-Key; ComponentLink2Description: https://datasheet.ciiva.com/2519/pyu-r-int-thick-7-2519093.pdf?src-supplier=Digi-Key; ComponentLink3URL: https://datasheet.ciiva.com/2519/pyu-r-int-thick-7-2519094.pdf?src-supplier=Digi-Key; ComponentLink3Description: https://datasheet.ciiva.com/2519/pyu-r-int-thick-7-2519094.pdf?src-supplier=Digi-Key; ComponentLink4URL: https://datasheet.ciiva.com/2519/pyu-r-int-thick-7-2519095.pdf?src-supplier=Digi-Key; ComponentLink4Description: https://datasheet.ciiva.com/2519/pyu-r-int-thick-7-2519095.pdf?src-supplier=Digi-Key; ComponentLink5URL: https://datasheet.ciiva.com/17052/pyu-rc0402-51-rohs-l-6-r-17052231.pdf?src-supplier=Future+Electronics; ComponentLink5Description: https://datasheet.ciiva.com/17052/pyu-rc0402-51-rohs-l-6-r-17052231.pdf?src-supplier=Future+Electronics; ComponentLink6URL: https://datasheet.ciiva.com/8885/pyu-rc0402-51-rohs-l-6-8885608.pdf?src-supplier=Avnet; ComponentLink6Description: https://datasheet.ciiva.com/8885/pyu-rc0402-51-rohs-l-6-8885608.pdf?src-supplier=Avnet; ComponentLink7URL: https://datasheet.ciiva.com/12577/pyu-rc0402-51-rohs-l-6-r-12577387.pdf?src-supplier=Mouser; ComponentLink7Description: https://datasheet.ciiva.com/12577/pyu-rc0402-51-rohs-l-6-r-12577387.pdf?src-supplier=Mouser
R9 = R-0402(1005): Fixed Resistor, Metal Glaze/thick Film, 0.0625W, 3300ohm, 50V, 1% +/-Tol, 100ppm/Cel, Surface Mount, 0402; Manufacturer: Yageo; Manufacturer Part Number: AC0402FR-073K3L; Power Rating: 62.5mW; Max Power Dissipation: 63mW; Temperature Coefficient: 100ppm/°C; Supplier 1: Digi-Key; Supplier Part Number 1: YAG3483CT-ND; RoHS: Yes; Category: Chip SMD Resistors; Pricing 1: 1=0.10000, 10=0.02100, 100=0.00870, 1000=0.00390, 2500=0.00338, 5000=0.00279 (USD); Case/Package: 0402; Case Code (Imperial): 0402; Case Code (Metric): 1005; Min Operating Temperature: -55°C; Max Operating Temperature: 155°C; Tolerance: 1%; Packaging: Tape and Reel; Resistance: 3.3kR; Voltage Rating: 50V; Composition: Thick Film; Number of Terminations: 2; Termination: SMD/SMT; Features: Moisture Resistant,Automotive AEC-Q200; Length: 0.039inch; Height: 0.015inch; Width: 0.02inch; Lead Free: Lead Free; ComponentLink1URL: https://datasheet.ciiva.com:443/pdfs/VipMasterIC/IC/YAGO/YAGO-S-A0003597364/YAGO-S-A0003597364-1.pdf?src-supplier=IHS+Markit; ComponentLink1Description: https://datasheet.ciiva.com:443/pdfs/VipMasterIC/IC/YAGO/YAGO-S-A0003597364/YAGO-S-A0003597364-1.pdf?src-supplier=IHS+Markit; ComponentLink2URL: http://www.mouser.com/ds/2/447/yageodocoutput-1111992.pdf?src-supplier=Mouser; ComponentLink2Description: http://www.mouser.com/ds/2/447/yageodocoutput-1111992.pdf?src-supplier=Mouser; ComponentLink3URL: http://www.yageo.com/NewPortal/yageodocoutput?fileName=/pdf/R-Chip/PYu-AC_51_RoHS_L_6.pdf&src-supplier=Digi-Key; ComponentLink3Description: http://www.yageo.com/NewPortal/yageodocoutput?fileName=/pdf/R-Chip/PYu-AC_51_RoHS_L_6.pdf&src-supplier=Digi-Key; ComponentLink4URL: http://www.yageo.com/documents/recent/PYu-AC_51_RoHS_L_2_revised.pdf?src-supplier=Future+Electronics; ComponentLink4Description: http://www.yageo.com/documents/recent/PYu-AC_51_RoHS_L_2_revised.pdf?src-supplier=Future+Electronics
R13 = R-0402(1005): Fixed Resistor, Metal Glaze/thick Film, 0.0625W, 20000ohm, 50V, 1% +/-Tol, 100ppm/Cel, Surface Mount, 0402; Manufacturer: Yageo; Manufacturer Part Number: AC0402FR-0720KL; Power Rating: 62.5mW; Max Power Dissipation: 63mW; Temperature Coefficient: 100ppm/°C; Supplier 1: Digi-Key; Supplier Part Number 1: YAG3454CT-ND; RoHS: Yes; Category: Chip SMD Resistors; Pricing 1: 1=0.10000, 10=0.02100, 100=0.00870, 1000=0.00390, 2500=0.00338, 5000=0.00279 (USD); Case/Package: 0402; Case Code (Imperial): 0402; Case Code (Metric): 1005; Min Operating Temperature: -55°C; Max Operating Temperature: 155°C; Packaging: Tape and Reel; Resistance: 20kR; Tolerance: 1%; Voltage Rating: 50V; Composition: Thick Film; Number of Terminations: 2; Termination: SMD/SMT; Features: Moisture Resistant,Automotive AEC-Q200; Length: 0.039inch; Height: 0.015inch; Width: 0.02inch; ComponentLink1URL: https://datasheet.ciiva.com:443/pdfs/VipMasterIC/IC/YAGO/YAGO-S-A0003597364/YAGO-S-A0003597364-1.pdf?src-supplier=IHS+Markit; ComponentLink1Description: https://datasheet.ciiva.com:443/pdfs/VipMasterIC/IC/YAGO/YAGO-S-A0003597364/YAGO-S-A0003597364-1.pdf?src-supplier=IHS+Markit; ComponentLink2URL: http://www.mouser.com/ds/2/447/yageodocoutput-1111992.pdf?src-supplier=Mouser; ComponentLink2Description: http://www.mouser.com/ds/2/447/yageodocoutput-1111992.pdf?src-supplier=Mouser; ComponentLink3URL: http://www.yageo.com/NewPortal/yageodocoutput?fileName=/pdf/R-Chip/PYu-AC_51_RoHS_L_6.pdf&src-supplier=Digi-Key; ComponentLink3Description: http://www.yageo.com/NewPortal/yageodocoutput?fileName=/pdf/R-Chip/PYu-AC_51_RoHS_L_6.pdf&src-supplier=Digi-Key
R14 = R-0402(1005): Fixed Resistor, Metal Glaze/thick Film, 0.0625W, 2000ohm, 50V, 1% +/-Tol, 100ppm/Cel, Surface Mount, 0402; Manufacturer: Yageo; Manufacturer Part Number: AC0402FR-072KL; Power Rating: 62.5mW; Max Power Dissipation: 63mW; Temperature Coefficient: 100ppm/°C; Supplier 1: Digi-Key; Supplier Part Number 1: YAG3470CT-ND; RoHS: Yes; Category: Chip SMD Resistors; Stock 1: 172746; Pricing 1: 1=0.10000, 10=0.02100, 100=0.00870, 1000=0.00390, 2500=0.00338, 5000=0.00279 (USD); Case/Package: 0402; Weight: 2.3E-05oz; Case Code (Imperial): 0402; Case Code (Metric): 1005; Min Operating Temperature: -55°C; Max Operating Temperature: 155°C; Tolerance: 1%; Packaging: Tape and Reel; Resistance: 2kR; Voltage Rating: 50V; Composition: Thick Film; Number of Terminations: 2; Termination: SMD/SMT; Features: Moisture Resistant,Automotive AEC-Q200; Length: 0.039inch; Height: 0.015inch; Width: 0.02inch; Lead Free: Lead Free; ComponentLink1URL: https://datasheet.ciiva.com:443/pdfs/VipMasterIC/IC/YAGO/YAGO-S-A0003597364/YAGO-S-A0003597364-1.pdf?src-supplier=IHS+Markit; ComponentLink1Description: https://datasheet.ciiva.com:443/pdfs/VipMasterIC/IC/YAGO/YAGO-S-A0003597364/YAGO-S-A0003597364-1.pdf?src-supplier=IHS+Markit; ComponentLink2URL: https://datasheet.ciiva.com/12576/pyu-ac-51-rohs-l-2-12576349.pdf?src-supplier=Mouser; ComponentLink2Description: https://datasheet.ciiva.com/12576/pyu-ac-51-rohs-l-2-12576349.pdf?src-supplier=Mouser